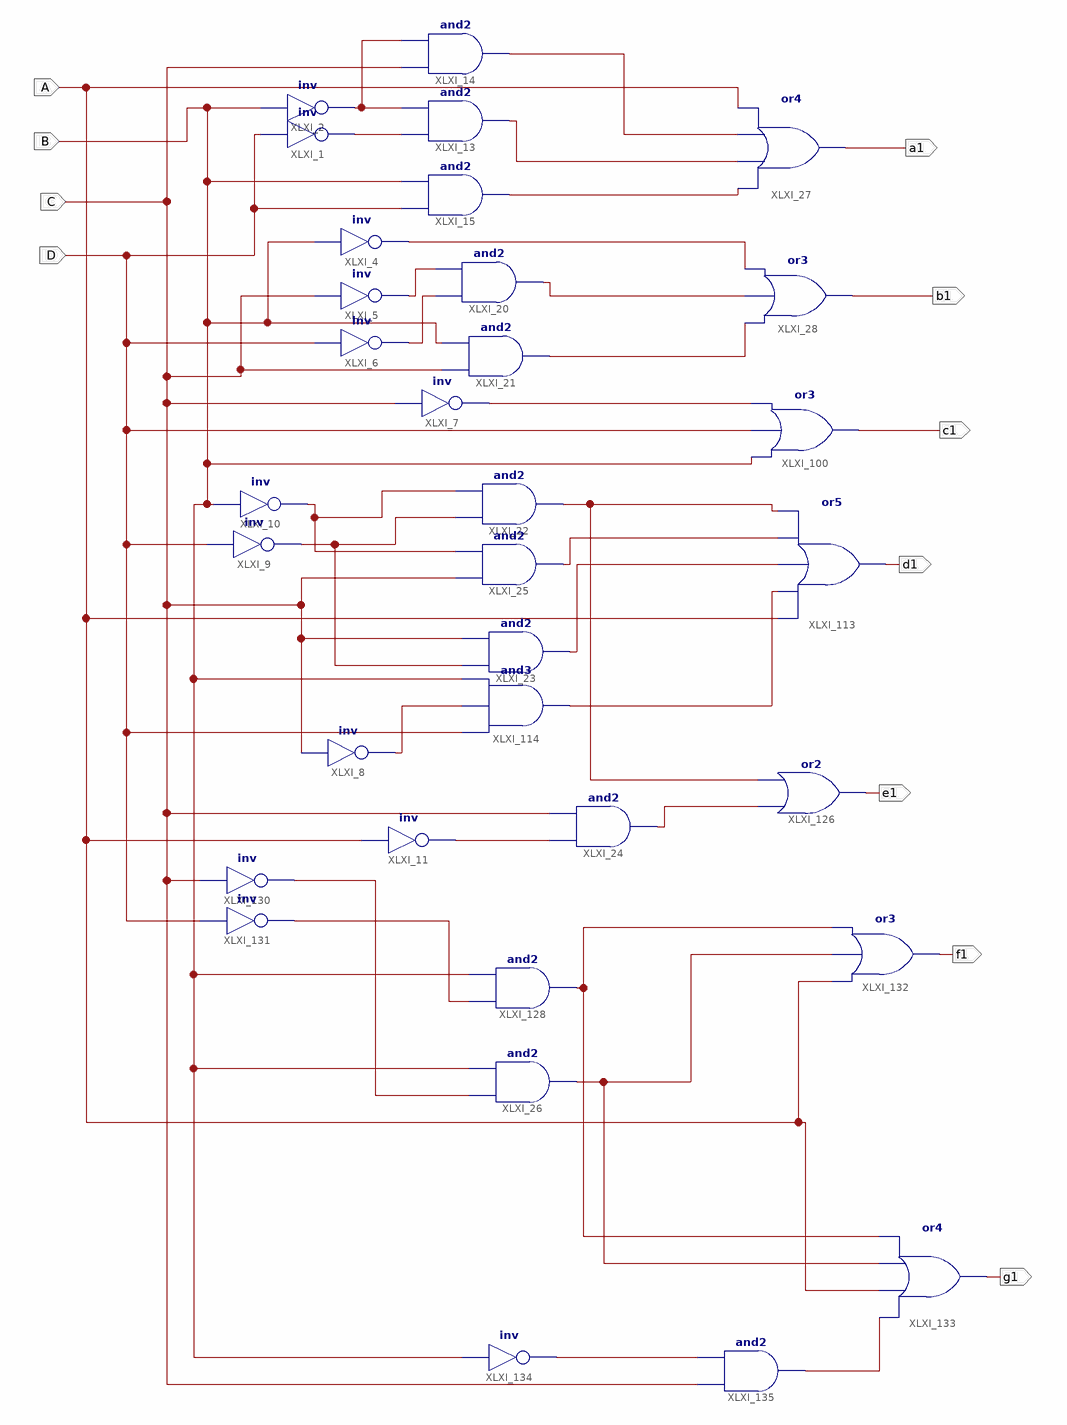
[diagram p0: schematic sheet 1]
// Xilinx ISE schematic segment.sch (spartan6) as structural Verilog: 33 symbols, 11 ports
module segment (
  input  A,
  input  D,
  input  B,
  input  C,
  output a1,
  output b1,
  output c1,
  output d1,
  output e1,
  output f1,
  output g1
);

  wire XLXN_11, XLXN_12, XLXN_26, XLXN_27, XLXN_28, XLXN_40, XLXN_41, XLXN_42, XLXN_43, XLXN_50, XLXN_116,
       XLXN_169, XLXN_174, XLXN_196, XLXN_198, XLXN_199, XLXN_200, XLXN_201, XLXN_272, XLXN_276, XLXN_300,
       XLXN_306, XLXN_312, XLXN_313, XLXN_326, XLXN_327;

  not XLXI_1 (XLXN_11, D);
  not XLXI_2 (XLXN_12, B);
  and XLXI_13 (XLXN_27, XLXN_11, XLXN_12);
  and XLXI_14 (XLXN_26, C, XLXN_12);
  and XLXI_15 (XLXN_28, D, B);
  or XLXI_27 (a1, XLXN_28, XLXN_27, XLXN_26, A);
  not XLXI_4 (XLXN_40, B);
  not XLXI_5 (XLXN_41, C);
  not XLXI_6 (XLXN_42, D);
  and XLXI_20 (XLXN_43, XLXN_42, XLXN_41);
  and XLXI_21 (XLXN_50, C, B);
  or XLXI_28 (b1, XLXN_50, XLXN_43, XLXN_40);
  and XLXI_24 (XLXN_276, XLXN_272, C);
  not XLXI_8 (XLXN_196, C);
  not XLXI_9 (XLXN_174, D);
  not XLXI_10 (XLXN_169, B);
  or XLXI_100 (c1, B, D, XLXN_116);
  not XLXI_7 (XLXN_116, C);
  or XLXI_113 (d1, A, XLXN_201, XLXN_200, XLXN_199, XLXN_198);
  and XLXI_114 (XLXN_201, D, XLXN_196, B);
  and XLXI_23 (XLXN_200, XLXN_174, C);
  and XLXI_22 (XLXN_198, XLXN_174, XLXN_169);
  and XLXI_25 (XLXN_199, C, XLXN_169);
  and XLXI_26 (XLXN_300, XLXN_306, B);
  not XLXI_11 (XLXN_272, A);
  or XLXI_126 (e1, XLXN_276, XLXN_198);
  and XLXI_128 (XLXN_313, XLXN_312, B);
  not XLXI_130 (XLXN_306, C);
  not XLXI_131 (XLXN_312, D);
  or XLXI_132 (f1, A, XLXN_300, XLXN_313);
  or XLXI_133 (g1, XLXN_327, A, XLXN_300, XLXN_313);
  not XLXI_134 (XLXN_326, B);
  and XLXI_135 (XLXN_327, C, XLXN_326);
endmodule
